# EAGLE schematic charlieplate8 (EAGLE 6.2)
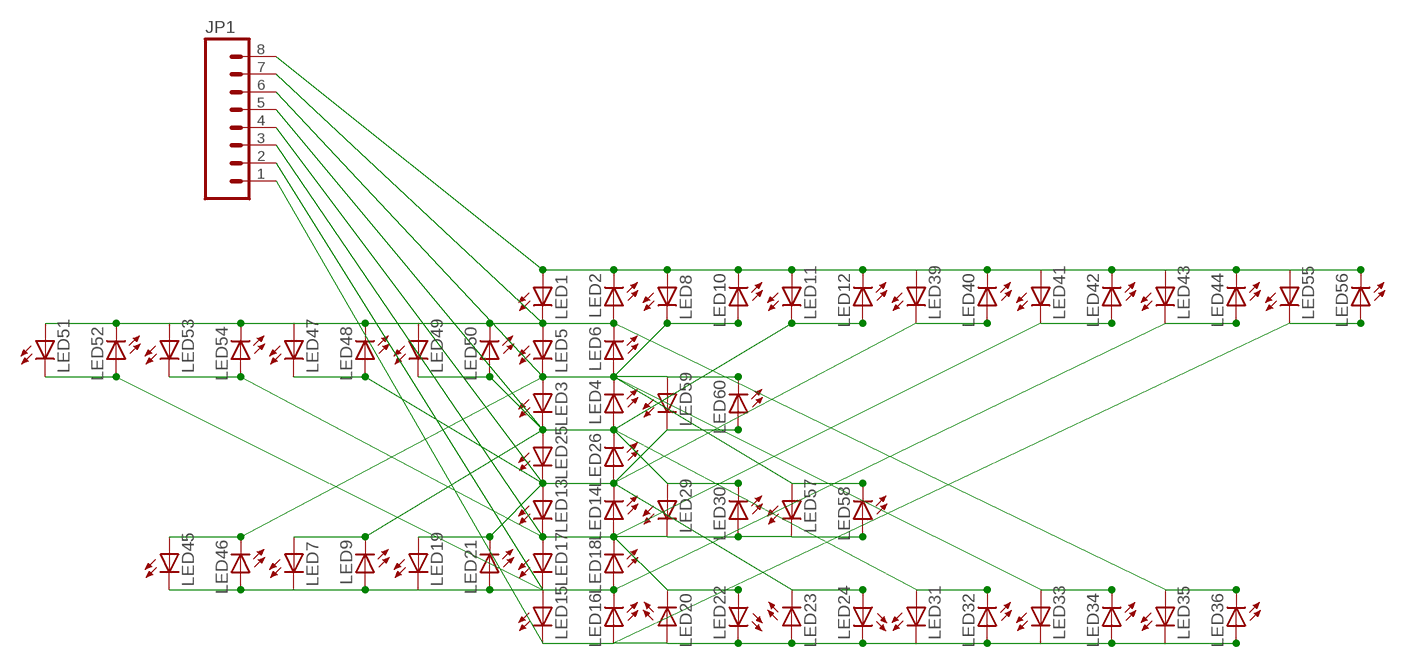
[diagram p0: schematic, sheet 1]

## Parts
JP1  M08  [1X08]
LED1  LED3MM  [LED3MM]
LED2  LED3MM  [LED3MM]
LED3  LED3MM  [LED3MM]
LED4  LED3MM  [LED3MM]
LED5  LED3MM  [LED3MM]
LED6  LED3MM  [LED3MM]
LED7  LED3MM  [LED3MM]
LED8  LED3MM  [LED3MM]
LED9  LED3MM  [LED3MM]
LED10  LED3MM  [LED3MM]
LED11  LED3MM  [LED3MM]
LED12  LED3MM  [LED3MM]
LED13  LED3MM  [LED3MM]
LED14  LED3MM  [LED3MM]
LED15  LED3MM  [LED3MM]
LED16  LED3MM  [LED3MM]
LED17  LED3MM  [LED3MM]
LED18  LED3MM  [LED3MM]
LED19  LED3MM  [LED3MM]
LED20  LED3MM  [LED3MM]
LED21  LED3MM  [LED3MM]
LED22  LED3MM  [LED3MM]
LED23  LED3MM  [LED3MM]
LED24  LED3MM  [LED3MM]
LED25  LED3MM  [LED3MM]
LED26  LED3MM  [LED3MM]
LED29  LED3MM  [LED3MM]
LED30  LED3MM  [LED3MM]
LED31  LED3MM  [LED3MM]
LED32  LED3MM  [LED3MM]
LED33  LED3MM  [LED3MM]
LED34  LED3MM  [LED3MM]
LED35  LED3MM  [LED3MM]
LED36  LED3MM  [LED3MM]
LED39  LED3MM  [LED3MM]
LED40  LED3MM  [LED3MM]
LED41  LED3MM  [LED3MM]
LED42  LED3MM  [LED3MM]
LED43  LED3MM  [LED3MM]
LED44  LED3MM  [LED3MM]
LED45  LED3MM  [LED3MM]
LED46  LED3MM  [LED3MM]
LED47  LED3MM  [LED3MM]
LED48  LED3MM  [LED3MM]
LED49  LED3MM  [LED3MM]
LED50  LED3MM  [LED3MM]
LED51  LED3MM  [LED3MM]
LED52  LED3MM  [LED3MM]
LED53  LED3MM  [LED3MM]
LED54  LED3MM  [LED3MM]
LED55  LED3MM  [LED3MM]
LED56  LED3MM  [LED3MM]
LED57  LED3MM  [LED3MM]
LED58  LED3MM  [LED3MM]
LED59  LED3MM  [LED3MM]
LED60  LED3MM  [LED3MM]

## Nets
N$1: JP1.8 LED1.A LED2.K(C) LED8.A LED10.K(C) LED11.A LED12.K(C) LED39.A LED40.K(C) LED41.A LED42.K(C) LED43.A LED44.K(C) LED55.A LED56.K(C)
N$3: LED11.K(C) LED12.A LED29.A LED30.K(C) LED31.A LED32.K(C)
N$5: JP1.1 LED15.K(C) LED16.A LED20.A LED22.K(C) LED23.A LED24.K(C) LED31.K(C) LED32.A LED33.K(C) LED34.A LED35.K(C) LED36.A LED55.K(C) LED56.A
N$9: JP1.3 LED13.K(C) LED14.A LED17.A LED18.K(C) LED20.K(C) LED22.A LED29.K(C) LED30.A LED41.K(C) LED42.A LED53.K(C) LED54.A LED57.K(C) LED58.A
N$10: JP1.6 LED3.A LED4.K(C) LED5.K(C) LED6.A LED8.K(C) LED10.A LED33.A LED34.K(C) LED45.A LED46.K(C) LED57.A LED58.K(C) LED59.A LED60.K(C)
N$11: JP1.4 LED13.A LED14.K(C) LED19.A LED21.K(C) LED23.K(C) LED24.A LED25.K(C) LED26.A LED39.K(C) LED40.A LED47.K(C) LED48.A LED59.K(C) LED60.A
N$14: JP1.5 LED3.K(C) LED4.A LED7.A LED9.K(C) LED25.A LED26.K(C) LED49.K(C) LED50.A
N$15: JP1.7 LED1.K(C) LED2.A LED5.A LED6.K(C) LED35.A LED36.K(C) LED47.A LED48.K(C) LED49.A LED50.K(C) LED51.A LED52.K(C) LED53.A LED54.K(C)
N$16: JP1.2 LED7.K(C) LED9.A LED15.A LED16.K(C) LED17.K(C) LED18.A LED19.K(C) LED21.A LED43.K(C) LED44.A LED45.K(C) LED46.A LED51.K(C) LED52.A

## Library data of the parts
JP1 = SparkFun:M08: Header 8 Standard 8-pin 0.1" header. Use with straight break away headers (SKU : PRT-00116), right angle break away headers (PRT-00553), swiss pins (PRT-00743), machine pins (PRT-00117), and female headers (PRT-00115).
LED1-LED26 LED29-LED36 LED39-LED60 = 0-svo:LED: LED OSRAM: - CHIPLED LG R971, LG N971, LY N971, LG Q971, LY Q971, LO R971, LY R971 LH N974, LH R974 LS Q976, LO Q976, LY Q976 LO Q996 - Hyper CHIPLED LW Q18S LB Q993, LB Q99A, LB R99A - SideLED LS A670, LO A670, LY A670, LG A670, LP A670 LB A673, LV A673, LT A673, LW A673 LH A674 LY A675 LS A676, LA A676, LO A676, LY A676, LW A676 LS A679, LY A679, LG A679 - Hyper Micro SIDELED® LS Y876, LA Y876, LO Y876, LY Y876 LT Y87S - SmartLED LW L88C, LW L88S LB L89C, LB L89S, LG L890 LS L89K, LO L89K, LY L89K LS L896, LA L896, LO L896, LY L896 - TOPLED LS T670, LO T670, LY T670, LG T670, LP T670 LSG T670, LSP T670, LSY T670, LOP T670, LYG T670 LG T671, LOG T671, LSG T671 LB T673, LV T673, LT T673, LW T673 LH T674 LS T676, LA T676, LO T676, LY T676, LB T676, LH T676, LSB T676, LW T676 LB T67C, LV T67C, LT T67C, LS T67K, LO T67K, LY T67K, LW E67C LS E67B, LA E67B, LO E67B, LY E67B, LB E67C, LV E67C, LT E67C LW T67C LS T679, LY T679, LG T679 LS T770, LO T770, LY T770, LG T770, LP T770 LB T773, LV T773, LT T773, LW T773 LH T774 LS E675, LA E675, LY E675, LS T675 LS T776, LA T776, LO T776, LY T776, LB T776 LHGB T686 LT T68C, LB T68C - Hyper Mini TOPLED® LB M676 - Mini TOPLED Santana® LG M470 LS M47K, LO M47K, LY M47K Source: http://www.osram.convergy.de/